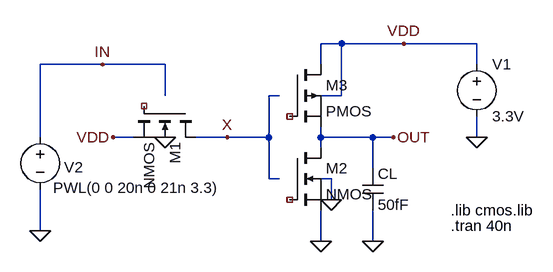
[diagram p0: schematic nmos_only_tb.asc]
nmos_only_tb.asc, the LTspice schematic file:
Version 4
SHEET 1 1292 680
WIRE -1152 -368 -1184 -368
WIRE -1056 -368 -1152 -368
WIRE -944 -368 -1056 -368
WIRE -1520 -336 -1616 -336
WIRE -1424 -336 -1520 -336
WIRE -1184 -336 -1184 -368
WIRE -944 -336 -944 -368
WIRE -1424 -288 -1424 -336
WIRE -1248 -288 -1264 -288
WIRE -1152 -288 -1152 -368
WIRE -1152 -288 -1184 -288
WIRE -1616 -224 -1616 -336
WIRE -1472 -224 -1504 -224
WIRE -1328 -224 -1376 -224
WIRE -1264 -224 -1264 -288
WIRE -1264 -224 -1328 -224
WIRE -1184 -224 -1184 -240
WIRE -1104 -224 -1184 -224
WIRE -1072 -224 -1104 -224
WIRE -944 -224 -944 -256
WIRE -1184 -208 -1184 -224
WIRE -1104 -176 -1104 -224
WIRE -1264 -160 -1264 -224
WIRE -1248 -160 -1264 -160
WIRE -1168 -160 -1184 -160
WIRE -1168 -128 -1168 -160
WIRE -1616 -80 -1616 -144
WIRE -1184 -64 -1184 -112
WIRE -1104 -64 -1104 -112
FLAG -944 -224 0
FLAG -1616 -80 0
FLAG -1104 -64 0
FLAG -1424 -224 0
FLAG -1184 -64 0
FLAG -1072 -224 OUT
FLAG -1168 -128 0
FLAG -1328 -224 X
FLAG -1056 -368 VDD
FLAG -1504 -224 VDD
FLAG -1520 -336 IN
SYMBOL voltage -944 -352 R0
WINDOW 123 0 0 Left 2
WINDOW 39 0 0 Left 2
SYMATTR InstName V1
SYMATTR Value 3.3V
SYMBOL voltage -1616 -240 R0
WINDOW 123 0 0 Left 2
WINDOW 39 0 0 Left 2
WINDOW 3 20 94 Left 2
WINDOW 0 37 62 Left 2
SYMATTR Value PWL(0 0 20n 0 21n 3.3)
SYMATTR InstName V2
SYMBOL cap -1120 -176 R0
SYMATTR InstName CL
SYMATTR Value 50fF
SYMBOL nmos -1376 -272 R90
SYMATTR InstName M1
SYMATTR Value2 l=0.6u w=1.5u
SYMATTR Value NMOS
SYMBOL nmos -1232 -208 R0
SYMATTR InstName M2
SYMATTR Value2 l=0.6u w=0.9u
SYMATTR Value NMOS
SYMBOL pmos -1232 -336 R0
SYMATTR InstName M3
SYMATTR Value2 l=0.6u w=0.9u
TEXT -984 -88 Left 2 !.tran 40n
TEXT -984 -112 Left 2 !.lib cmos.lib

The netlist it stands for:
* nmos_only_tb.asc
V1 VDD 0 3.3V
V2 IN 0 PWL(0 0 20n 0 21n 3.3)
CL OUT 0 50fF
* M1: NMOS l=0.6u w=1.5u (symbol nmos not certain, pin order unknown); nets seen at it: VDD, X
* M2: NMOS l=0.6u w=0.9u (symbol nmos not certain, pin order unknown); nets seen at it: 0, OUT
* M3: PMOS l=0.6u w=0.9u (symbol pmos not certain, pin order unknown); nets seen at it: OUT, VDD
.tran 40n
.lib cmos.lib
.backanno
.end